# Altium schematic sheet RTC 1307.SchDoc
size A4
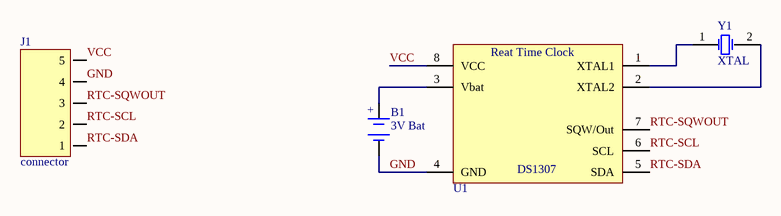
[diagram p0: RTC 1307.SchDoc]

## Parts
B1  3V Bat  [CR2032 DIP]
J1  connector  [Line 2.54 x 5]
U1  DS1307  [DIP-8]  (value not drawn)
Y1  XTAL  [XTAL - Clock R]

## Nets
GND: B1.2(GND) J1.4 U1.4(GND)
RTC-SCL: J1.2 U1.6(SCL)
RTC-SDA: J1.1 U1.5(SDA)
RTC-SQWOUT: J1.3 U1.7(SQW/Out)
VCC: J1.5 U1.8(VCC)
NetB1_1: B1.1(VC) U1.3(Vbat)
NetU1_1: U1.1(XTAL1) Y1.1(OSC1)
NetU1_2: U1.2(XTAL2) Y1.2(OSC2)

## Notes on the sheet
- (in symbol Battery) +
- (in symbol RTC DS1307) Reat Time Clock

## Library data of the parts
B1 = Battery
J1 = PLS-5: Vert, Sgl line, Male
U1 = RTC DS1307: (RTC) Real Time Clock; PackageDescription: DIP; 8 Leads; Row Spacing 7.62 mm; Pitch 2.54 mm / SO-8; Datasheet: http://cxem.net/arduino/files/arduino120_DS1307_datashit.pdf
Y1 = XTAL: Crystal Oscillator; Published: 8-Jun-2000; LatestRevisionDate: 17-Jul-2002; LatestRevisionNote: Re-released for DXP Platform.; PackageReference: R38; Publisher: Altium Limited; PackageDescription: Crystal, Thru-Hole; 2 Leads; Body 3.1 x 8.2 mm (Dia.xH)